# EAGLE design LilyPad_Slide_Switch (EAGLE 7.7.0)
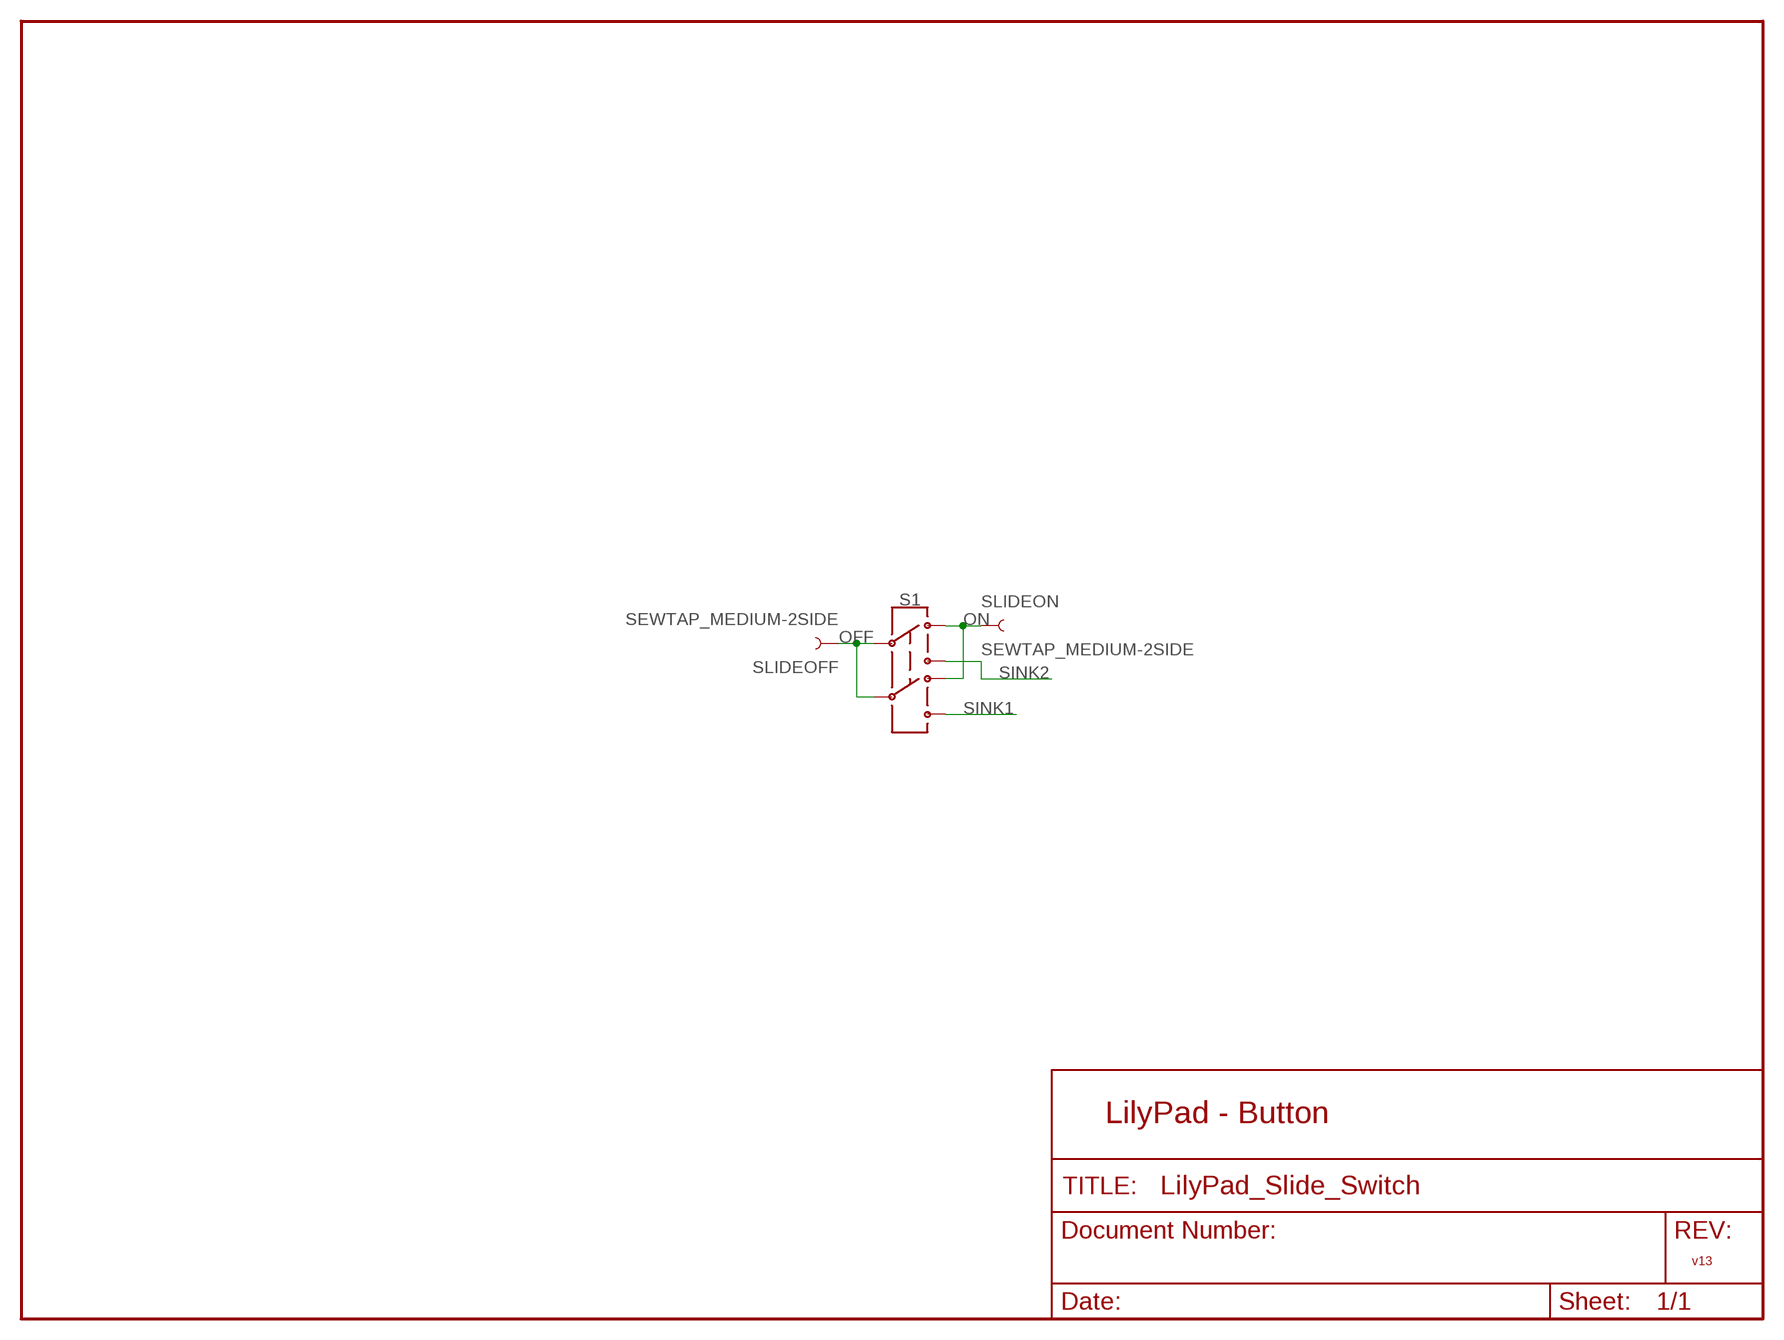
[diagram p0: schematic, sheet 1]

## Parts
S1  SWITCH-DPDT-SMD-AYZ0202  [SWITCH_DPDT_SMD_AYZ0202]
SLIDEOFF  SEWTAP_MEDIUM-2SIDE  [PETAL-MEDIUM-2SIDE]
SLIDEON  SEWTAP_MEDIUM-2SIDE  [PETAL-MEDIUM-2SIDE]

## Nets
OFF: S1.2 S1.5 SLIDEOFF.1
ON: S1.1 S1.4 SLIDEON.1
SINK1: S1.6
SINK2: S1.3

## Notes on the sheet
- LilyPad - Button
- v13

## Library data of the parts
S1 = SparkFun-Switches:SWITCH-DPDT: Double-Pole, Double-Throw (DPDT) Switch Double-pole, double-throw switches. Variant Overview PTH-GPI-152-3013 Used on SparkFun Geiger Counter <https://www.sparkfun.com/products/11345> SMD-AY0202 Surface Mount DPDT Switch <https://www.sparkfun.com/products/597> (COM-00597) Used on e.g. LilyPad Arduino USB - ATmega32U4 Board <https://www.sparkfun.com/products/12049>; PROD_ID: SWCH-08179; SF_SKU: COM-00597
SLIDEOFF SLIDEON = LilyPad-Wearables:SEWTAP: SparkFun LilyPad Sew Taps Sewable connection points for LilyPad Boards SparkFun Products: LilyPad Arduino 328 Main Board <https://www.sparkfun.com/products/13342> LilyTiny <https://www.sparkfun.com/products/10899> LilyPad Power Supply <https://www.sparkfun.com/products/11259>

## Board
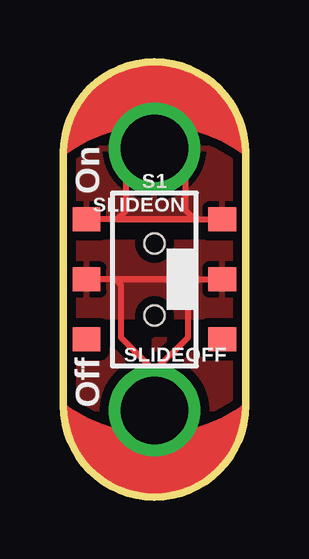
[diagram p1: board, top side]
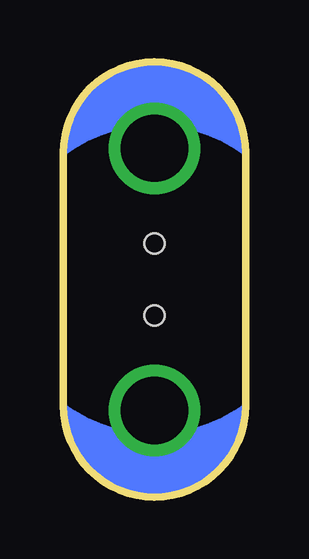
[diagram p2: board, bottom side, seen from below]

Size 7.6 x 18.14 mm. Coordinates in mm from the lower left corner, seen from the top.
Outline: 0,14.34 arc-180 7.6,14.34 7.6,3.8 arc-180 0,3.8 0,14.34
Copper layers (1*16): Top 0.035mm / dielectric 1.5mm / Bottom 0.035mm
Design rules "SparkFun": minimum track width 8mil, minimum drill 20mil, track to track 8mil, track to pad 8mil, pad to pad 8mil, via to via 8mil, smd to smd 8mil, copper to edge 10mil, drill to drill 8mil, minimum pad ring 12mil, minimum via ring 10mil, stop-mask expansion 4mil, vias tented up to drill 25mil, thermal gap 10mil

### Footprints (pad centres in the part's own frame; a part is rotated, then mirrored left to right if it is on the bottom)
SWITCH_DPDT_SMD_AYZ0202 = smd 1 x 1.15: 1 -2.5,2.825; 2 0,2.825; 3 2.5,2.825; 4 -2.5,-2.825; 5 0,-2.825; 6 2.5,-2.825 | hole 0.85: 1.5,0; -1.5,0
PETAL-MEDIUM-2SIDE = drill 2.794: 1 0,-0.254

### Placement (x,y rotation side)
S1  3.8,9.07 270 top
SLIDEOFF  3.8,3.86 0 top
SLIDEON  3.8,14.28 180 top

### Tracks (layer width: path | path; a pad name or v marks a point on that pad's centre or on a via)
OFF
  Top 0.254: S1.2 2.17,9.07 2.4,8.84 2.4,6.66 3.8,5.26 | S1.5 5.33,9.07 5.2,8.94 5.2,6.66 3.8,5.26 | 3.8,5.26 SLIDEOFF.1
  pour Top (isolate 0.381): 7.61,10.59 -0.01,10.59 -0.01,7.55 7.61,7.55
ON
  Top 0.254: S1.1 2.23,11.57 2.6,11.94 2.6,13.35 2.62,13.35 SLIDEON.1 5.1,13.23 5.1,11.94 5.47,11.57 S1.4
  pour Top (isolate 0.381): 7.61,11.61 7.61,13.77 6.47,14.4 5.32,14.79 4.43,15.04 2.91,15.04 1.77,14.66 0.62,14.02 -0.01,13.64 -0.01,11.61
SINK1
  pour Top (isolate 0.381): 7.61,6.53 3.8,6.53 3.8,3.99 arc-223 4.31,3.1 4.69,3.1 5.83,3.43 6.85,3.91 7.61,4.5
SINK2
  pour Top (isolate 0.381): 2.53,6.53 -0.01,6.53 -0.01,4.37 1.13,3.74 2.4,3.23 3.04,3.1 3.55,5.13

### Text on the board
tPlace: On | Off